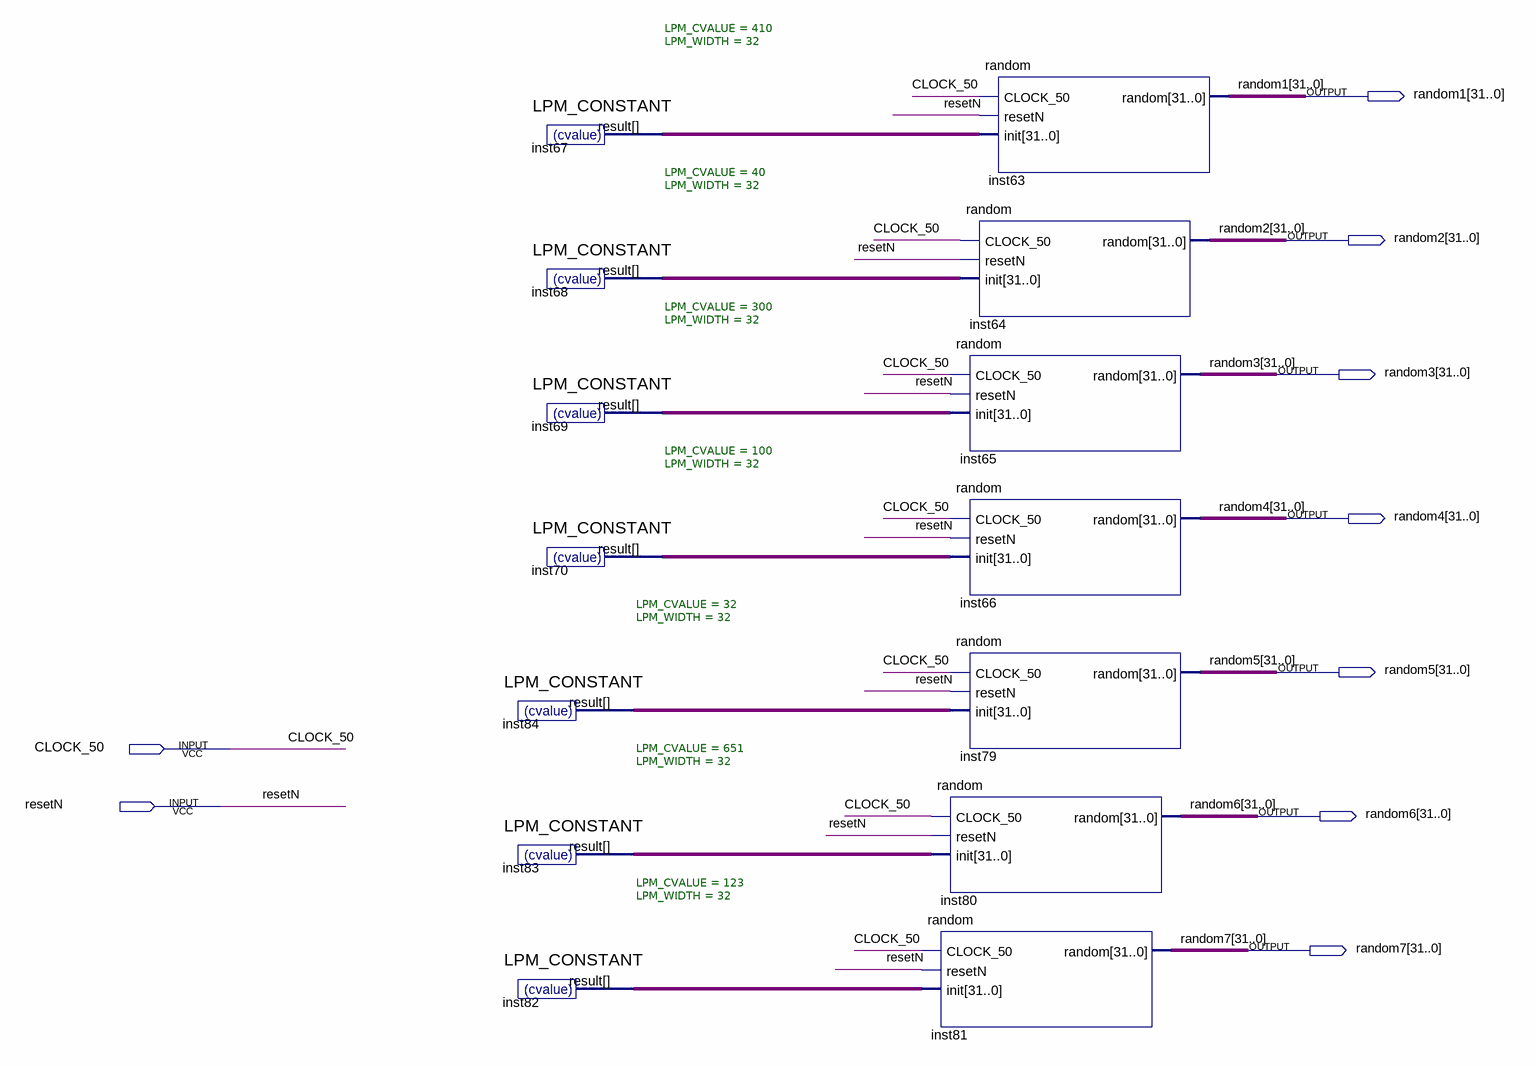
[diagram p0: schematic sheet]
// Quartus schematic random_top.bdf as structural Verilog: 14 symbols, 9 pins
module random_top (
  input  CLOCK_50,
  input  resetN,
  output [31:0] random1,
  output [31:0] random2,
  output [31:0] random3,
  output [31:0] random4,
  output [31:0] random5,
  output [31:0] random6,
  output [31:0] random7
);

  wire [31:0] inst67_result, inst68_result, inst69_result, inst70_result, inst82_result, inst83_result,
       inst84_result;

  LPM_CONSTANT #(.LPM_CVALUE(410), .LPM_WIDTH(32)) inst67 (.result(inst67_result));
  LPM_CONSTANT #(.LPM_CVALUE(40), .LPM_WIDTH(32)) inst68 (.result(inst68_result));
  LPM_CONSTANT #(.LPM_CVALUE(300), .LPM_WIDTH(32)) inst69 (.result(inst69_result));
  LPM_CONSTANT #(.LPM_CVALUE(100), .LPM_WIDTH(32)) inst70 (.result(inst70_result));
  LPM_CONSTANT #(.LPM_CVALUE(32), .LPM_WIDTH(32)) inst84 (.result(inst84_result));
  LPM_CONSTANT #(.LPM_CVALUE(651), .LPM_WIDTH(32)) inst83 (.result(inst83_result));
  LPM_CONSTANT #(.LPM_CVALUE(123), .LPM_WIDTH(32)) inst82 (.result(inst82_result));
  random inst80 (.CLOCK_50(CLOCK_50), .resetN(resetN), .init(inst83_result), .random(random6));
  random inst81 (.CLOCK_50(CLOCK_50), .resetN(resetN), .init(inst82_result), .random(random7));
  random inst63 (.CLOCK_50(CLOCK_50), .resetN(resetN), .init(inst67_result), .random(random1));
  random inst64 (.CLOCK_50(CLOCK_50), .resetN(resetN), .init(inst68_result), .random(random2));
  random inst65 (.CLOCK_50(CLOCK_50), .resetN(resetN), .init(inst69_result), .random(random3));
  random inst66 (.CLOCK_50(CLOCK_50), .resetN(resetN), .init(inst70_result), .random(random4));
  random inst79 (.CLOCK_50(CLOCK_50), .resetN(resetN), .init(inst84_result), .random(random5));
endmodule
